# Altium schematic sheet OptoIsolator.SchDoc
size A
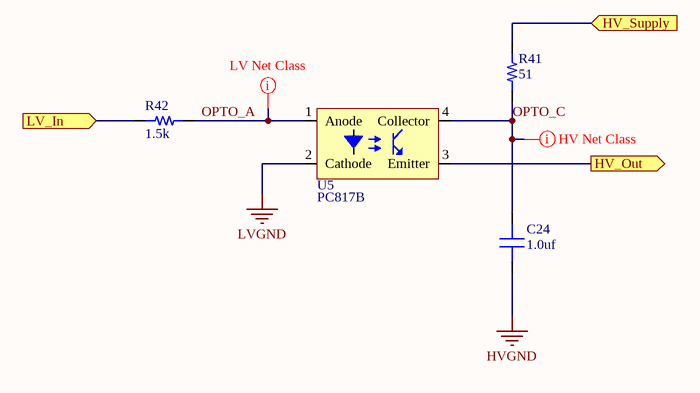
[diagram p0: OptoIsolator.SchDoc]

## Parts
C24  value 1.0uf  [CAP 0603/1608]  (hidden comment: Capacitor MLCC 1.0uf 25V CAP 0603/1608)
R41  value 51  [RES 0805/2012]  (hidden comment: Resistor 51 0805 1/4W 1%)
R42  value 1.5k  [RES 0603/1608]  (hidden comment: Resistor 1.5k 0603 1/10W 1%)
U5  PC817B  [SOIC-4]

## Ports
HV_Out (out), HV_Supply (in), LV_In (in)

## Nets
HVGND: C24.1
LVGND: U5.2(Cathode)
HV_Out: U5.3(Emitter) ; port HV_Out
HV_Supply: R41.2 ; port HV_Supply
LV_In: R42.1 ; port LV_In
OPTO_A: R42.2 U5.1(Anode)
OPTO_C: C24.2 R41.1 U5.4(Collector)

## Layout directives
mark named LV Net Class: OPTO_A
net class HV: OPTO_C

## Library data of the parts
C24 = 589: Manufacturer_id: 1; idCapacitor: 589; Name: Cap_1.0uf_25V_CAP 0603/1608; Dielectric: Ceramic; Created_By: Nick Mah; Drawer_id: 1; Voltage_Rating: 25V; Package: CAP 0603/1608; Created_Date: 10/20/2018
R41 = 690: Manufacturer_id: 1; idResistor: 690; Name: Res_51_0805_1/4W_1%; Created_By: Nick Mah; Supplier 1: Digi-Key; Drawer_id: 1; Tolerance: 1%; Power: 1/4W; Package: 0805; ComponentLink1Description: Datasheet; Created_Date: 2018-10-20
R42 = 293: Manufacturer_id: 1; idResistor: 293; Name: Res_1.5k_0603_1/10W_1%; Created_By: Nick Mah; Supplier 1: Digi-Key; Drawer_id: 1; Tolerance: 1%; Power: 1/10W; Package: 0603; ComponentLink1Description: Datasheet; Created_Date: 2018-10-20
U5 = 36: Optoisolator Darlington Output 2500Vrms 1 Channel 4-SSOP; Manufacturer_id: 1; idIC_Misc: 36; Name: PS2802-1-A; Value: 90mA, 40VCe; Protocol: Null; Vin(Max): 80V Vce; Created_By: Nick Mah; Drawer_id: 1; Type: Optoisolator; Num_Circuits: 1; Package: SOIC-4; MfrPartNo: PS2802-1-A; Link: https://www.digikey.com/product-detail/en/renesas-electronics-america/PS2802-1-A/559-1102-ND/9564743; ComponentLink1Description: Datasheet; ComponentLink1URL: https://www.renesas.com/en-us/doc/YOUSYS/document/002/PN10252EJ02V0DS.pdf; Supplier1: Digi-Key; Supplier1PartNo: 559-1102-ND